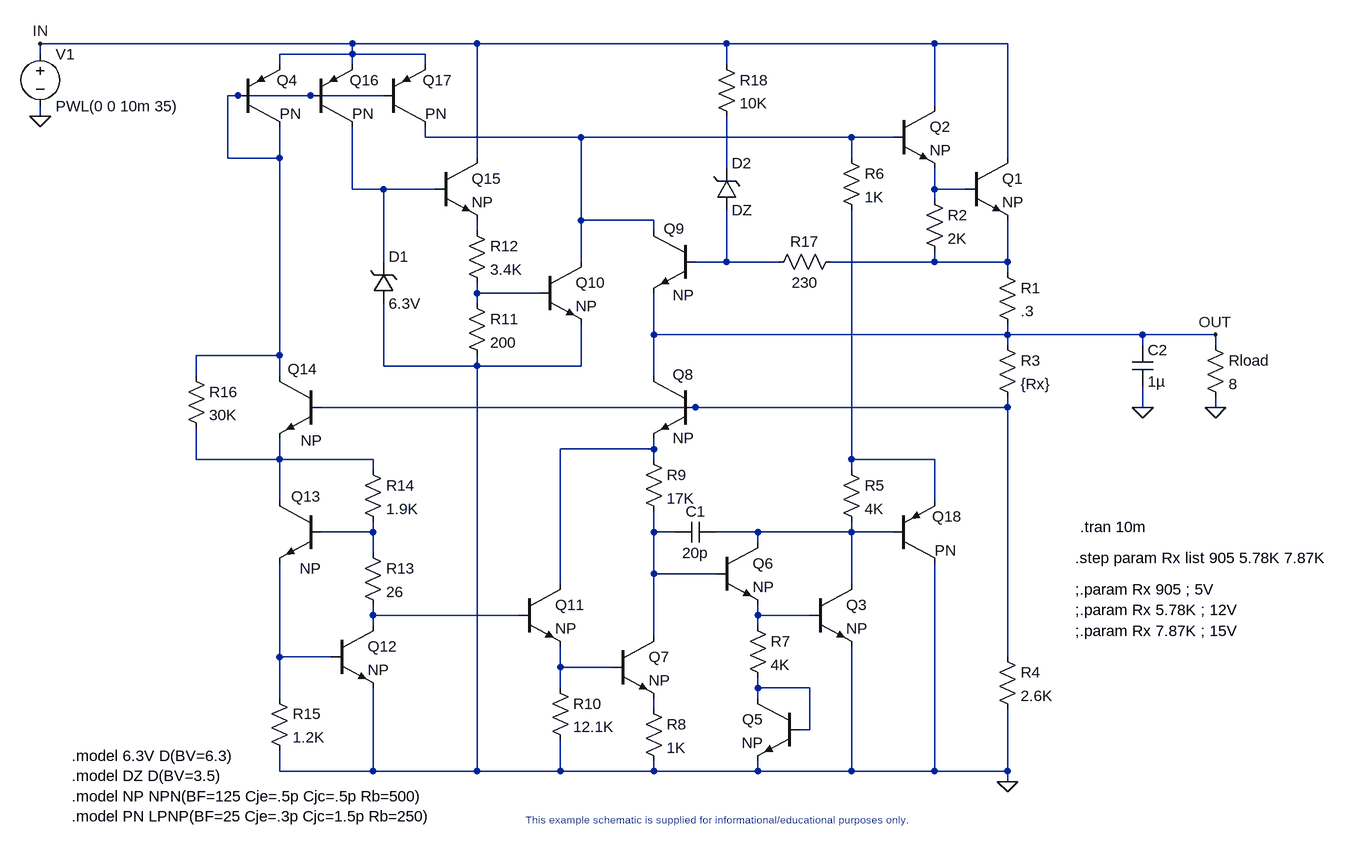
[diagram p0: schematic LM78XX.asc]
LM78XX.asc, the LTspice schematic file:
Version 4
SHEET 1 2980 1688
WIRE 928 320 448 320
WIRE 1120 320 928 320
WIRE 1504 320 1120 320
WIRE 1824 320 1504 320
WIRE 1936 320 1824 320
WIRE 448 336 448 320
WIRE 928 336 928 320
WIRE 928 336 816 336
WIRE 1040 336 928 336
WIRE 816 352 816 336
WIRE 928 352 928 336
WIRE 1040 352 1040 336
WIRE 1504 352 1504 320
WIRE 752 400 736 400
WIRE 864 400 752 400
WIRE 976 400 864 400
WIRE 1824 416 1824 320
WIRE 448 432 448 416
WIRE 1040 464 1040 448
WIRE 1280 464 1040 464
WIRE 1696 464 1280 464
WIRE 1760 464 1696 464
WIRE 736 496 736 400
WIRE 816 496 816 448
WIRE 816 496 736 496
WIRE 1120 496 1120 320
WIRE 1696 496 1696 464
WIRE 1936 496 1936 320
WIRE 1504 512 1504 432
WIRE 928 544 928 448
WIRE 976 544 928 544
WIRE 1056 544 976 544
WIRE 1824 544 1824 512
WIRE 1872 544 1824 544
WIRE 1824 560 1824 544
WIRE 1280 592 1280 464
WIRE 1392 592 1280 592
WIRE 1120 608 1120 592
WIRE 1392 608 1392 592
WIRE 976 656 976 544
WIRE 1280 656 1280 592
WIRE 1504 656 1504 576
WIRE 1504 656 1456 656
WIRE 1584 656 1504 656
WIRE 1824 656 1824 640
WIRE 1824 656 1664 656
WIRE 1936 656 1936 592
WIRE 1936 656 1824 656
WIRE 1936 672 1936 656
WIRE 1120 704 1120 688
WIRE 1216 704 1120 704
WIRE 1120 720 1120 704
WIRE 1392 768 1392 704
WIRE 1936 768 1936 752
WIRE 1936 768 1392 768
WIRE 2144 768 1936 768
WIRE 2256 768 2144 768
WIRE 1936 784 1936 768
WIRE 2144 784 2144 768
WIRE 2256 784 2256 768
WIRE 816 800 816 496
WIRE 816 800 688 800
WIRE 976 816 976 720
WIRE 1120 816 1120 800
WIRE 1120 816 976 816
WIRE 1280 816 1280 752
WIRE 1280 816 1120 816
WIRE 688 832 688 800
WIRE 816 832 816 800
WIRE 1392 832 1392 768
WIRE 1456 880 880 880
WIRE 1936 880 1936 864
WIRE 1936 880 1456 880
WIRE 2144 880 2144 848
WIRE 2256 880 2256 864
WIRE 1392 944 1392 928
WIRE 1392 944 1248 944
WIRE 688 960 688 912
WIRE 816 960 816 928
WIRE 816 960 688 960
WIRE 960 960 816 960
WIRE 1392 960 1392 944
WIRE 1696 960 1696 576
WIRE 1824 960 1696 960
WIRE 960 976 960 960
WIRE 1696 976 1696 960
WIRE 816 1024 816 960
WIRE 1824 1024 1824 960
WIRE 960 1072 960 1056
WIRE 960 1072 880 1072
WIRE 1392 1072 1392 1040
WIRE 1424 1072 1392 1072
WIRE 1552 1072 1488 1072
WIRE 1696 1072 1696 1056
WIRE 1696 1072 1552 1072
WIRE 1760 1072 1696 1072
WIRE 1552 1088 1552 1072
WIRE 960 1104 960 1072
WIRE 1392 1136 1392 1072
WIRE 1488 1136 1392 1136
WIRE 1248 1152 1248 944
WIRE 1696 1152 1696 1072
WIRE 960 1200 960 1184
WIRE 1184 1200 960 1200
WIRE 1552 1200 1552 1184
WIRE 1632 1200 1552 1200
WIRE 960 1216 960 1200
WIRE 1552 1216 1552 1200
WIRE 1392 1232 1392 1136
WIRE 816 1264 816 1120
WIRE 896 1264 816 1264
WIRE 1936 1264 1936 880
WIRE 1248 1280 1248 1248
WIRE 1328 1280 1248 1280
WIRE 1248 1312 1248 1280
WIRE 1552 1312 1552 1296
WIRE 1632 1312 1552 1312
WIRE 816 1328 816 1264
WIRE 1552 1328 1552 1312
WIRE 1392 1344 1392 1328
WIRE 1632 1376 1632 1312
WIRE 1632 1376 1616 1376
WIRE 816 1440 816 1408
WIRE 960 1440 960 1312
WIRE 960 1440 816 1440
WIRE 1120 1440 1120 816
WIRE 1120 1440 960 1440
WIRE 1248 1440 1248 1392
WIRE 1248 1440 1120 1440
WIRE 1392 1440 1392 1424
WIRE 1392 1440 1248 1440
WIRE 1552 1440 1552 1424
WIRE 1552 1440 1392 1440
WIRE 1696 1440 1696 1248
WIRE 1696 1440 1552 1440
WIRE 1824 1440 1824 1120
WIRE 1824 1440 1696 1440
WIRE 1936 1440 1936 1344
WIRE 1936 1440 1824 1440
WIRE 1936 1456 1936 1440
FLAG 1936 1456 0
FLAG 2256 768 OUT
FLAG 448 320 IN
FLAG 448 432 0
FLAG 2256 880 0
FLAG 2144 880 0
SYMBOL NPN 1872 496 R0
SYMATTR InstName Q1
SYMATTR Value NP
SYMBOL npn 1760 416 R0
SYMATTR InstName Q2
SYMATTR Value NP
SYMBOL RES 1920 656 R0
SYMATTR InstName R1
SYMATTR Value .3
SYMBOL res 1808 544 R0
SYMATTR InstName R2
SYMATTR Value 2K
SYMBOL res 1920 768 R0
SYMATTR InstName R3
SYMATTR Value {Rx}
SYMBOL res 1920 1248 R0
SYMATTR InstName R4
SYMATTR Value 2.6K
SYMBOL npn 1632 1152 R0
SYMATTR InstName Q3
SYMATTR Value NP
SYMBOL PNP 752 448 M180
WINDOW 0 60 72 Left 2
WINDOW 3 64 20 Left 2
SYMATTR InstName Q4
SYMATTR Value PN
SYMBOL res 1680 960 R0
SYMATTR InstName R5
SYMATTR Value 4K
SYMBOL res 1680 480 R0
SYMATTR InstName R6
SYMATTR Value 1K
SYMBOL npn 1616 1328 M0
SYMATTR InstName Q5
SYMATTR Value NP
SYMBOL res 1536 1200 R0
SYMATTR InstName R7
SYMATTR Value 4K
SYMBOL npn 1488 1088 R0
SYMATTR InstName Q6
SYMATTR Value NP
SYMBOL cap 1488 1056 R90
WINDOW 0 0 32 VBottom 2
WINDOW 3 32 32 VTop 2
SYMATTR InstName C1
SYMATTR Value 20p
SYMBOL npn 1328 1232 R0
SYMATTR InstName Q7
SYMATTR Value NP
SYMBOL res 1376 1328 R0
SYMATTR InstName R8
SYMATTR Value 1K
SYMBOL res 1376 944 R0
SYMATTR InstName R9
SYMATTR Value 17K
SYMBOL npn 1456 832 M0
WINDOW 0 35 -3 Right 2
WINDOW 3 35 95 Right 2
SYMATTR InstName Q8
SYMATTR Value NP
SYMBOL npn 1456 608 M0
WINDOW 0 49 -3 Right 2
WINDOW 3 35 99 Right 2
SYMATTR InstName Q9
SYMATTR Value NP
SYMBOL npn 1216 656 R0
SYMATTR InstName Q10
SYMATTR Value NP
SYMBOL npn 1184 1152 R0
SYMATTR InstName Q11
SYMATTR Value NP
SYMBOL res 1232 1296 R0
SYMATTR InstName R10
SYMATTR Value 12.1K
SYMBOL res 1104 704 R0
SYMATTR InstName R11
SYMATTR Value 200
SYMBOL res 1104 592 R0
SYMATTR InstName R12
SYMATTR Value 3.4K
SYMBOL npn 896 1216 R0
SYMATTR InstName Q12
SYMATTR Value NP
SYMBOL res 944 1088 R0
SYMATTR InstName R13
SYMATTR Value 26
SYMBOL res 944 960 R0
SYMATTR InstName R14
SYMATTR Value 1.9K
SYMBOL npn 880 1024 M0
WINDOW 0 46 -7 Right 2
WINDOW 3 33 104 Right 2
SYMATTR InstName Q13
SYMATTR Value NP
SYMBOL res 800 1312 R0
SYMATTR InstName R15
SYMATTR Value 1.2K
SYMBOL npn 880 832 M0
WINDOW 0 51 -11 Right 2
WINDOW 3 31 99 Right 2
SYMATTR InstName Q14
SYMATTR Value NP
SYMBOL res 672 816 R0
SYMATTR InstName R16
SYMATTR Value 30K
SYMBOL npn 1056 496 R0
SYMATTR InstName Q15
SYMATTR Value NP
SYMBOL zener 960 720 M180
WINDOW 0 24 72 Left 2
WINDOW 3 24 0 Left 2
SYMATTR InstName D1
SYMATTR Value 6.3V
SYMBOL res 1680 640 R90
WINDOW 0 0 56 VBottom 2
WINDOW 3 32 56 VTop 2
SYMATTR InstName R17
SYMATTR Value 230
SYMBOL zener 1488 576 M180
WINDOW 0 24 72 Left 2
WINDOW 3 24 0 Left 2
SYMATTR InstName D2
SYMATTR Value DZ
SYMBOL res 1488 336 R0
SYMATTR InstName R18
SYMATTR Value 10K
SYMBOL pnp 864 448 M180
WINDOW 0 60 72 Left 2
WINDOW 3 64 20 Left 2
SYMATTR InstName Q16
SYMATTR Value PN
SYMBOL pnp 976 448 M180
WINDOW 0 60 72 Left 2
WINDOW 3 64 20 Left 2
SYMATTR InstName Q17
SYMATTR Value PN
SYMBOL cap 2128 784 R0
SYMATTR InstName C2
SYMATTR Value 1µ
SYMBOL res 2240 768 R0
SYMATTR InstName Rload
SYMATTR Value 8
SYMBOL VOLTAGE 448 320 R0
SYMATTR InstName V1
SYMATTR Value PWL(0 0 10m 35)
SYMBOL pnp 1760 1120 M180
WINDOW 0 60 72 Left 2
WINDOW 3 64 20 Left 2
SYMATTR InstName Q18
SYMATTR Value PN
TEXT 496 1416 Left 2 !.model 6.3V D(BV=6.3)\n.model DZ D(BV=3.5)\n.model NP NPN(BF=125 Cje=.5p Cjc=.5p Rb=500)\n.model PN LPNP(BF=25 Cje=.3p Cjc=1.5p Rb=250)
TEXT 2048 1064 Left 2 !.tran 10m
TEXT 2040 1160 Left 2 !;.param Rx 905 ; 5V
TEXT 2040 1192 Left 2 !;.param Rx 5.78K ; 12V
TEXT 2040 1224 Left 2 !;.param Rx 7.87K ; 15V
TEXT 1480 1504 Top 1 ;This example schematic is supplied for informational/educational purposes only.
TEXT 2040 1112 Left 2 !.step param Rx list 905 5.78K 7.87K

The netlist it stands for:
* LM78XX.asc
Q1 IN N005 N008 0 NP
Q2 IN N002 N005 0 NP
R1 N008 OUT .3
R2 N005 N008 2K
R3 OUT N010 {Rx}
R4 N010 0 2.6K
Q3 N016 N018 0 0 NP
Q4 N001 N001 IN 0 PN
R5 N013 N016 4K
R6 N002 N013 1K
Q5 N021 N021 0 0 NP
R7 N018 N021 4K
Q6 N016 N015 N018 0 NP
C1 N016 N015 20p
Q7 N015 N020 N022 0 NP
R8 N022 0 1K
R9 N011 N015 17K
Q8 OUT N010 N011 0 NP
Q9 N002 N007 OUT 0 NP
Q10 N002 N009 0 0 NP
Q11 N011 N017 N020 0 NP
R10 N020 0 12.1K
R11 N009 0 200
R12 N006 N009 3.4K
Q12 N017 N019 0 0 NP
R13 N014 N017 26
R14 N012 N014 1.9K
Q13 N012 N014 N019 0 NP
R15 N019 0 1.2K
Q14 N001 N010 N012 0 NP
R16 N001 N012 30K
Q15 IN N004 N006 0 NP
D1 0 N004 6.3V
R17 N008 N007 230
D2 N007 N003 DZ
R18 IN N003 10K
Q16 N004 N001 IN 0 PN
Q17 N002 N001 IN 0 PN
C2 OUT 0 1µ
Rload OUT 0 8
V1 IN 0 PWL(0 0 10m 35)
Q18 0 N016 N013 0 PN
.model D D
.lib standard.dio
.model NPN NPN
.model PNP PNP
.lib standard.bjt
.model 6.3V D(BV=6.3)
.model DZ D(BV=3.5)
.model NP NPN(BF=125 Cje=.5p Cjc=.5p Rb=500)
.model PN LPNP(BF=25 Cje=.3p Cjc=1.5p Rb=250)
.tran 10m
;.param Rx 905 ; 5V
;.param Rx 5.78K ; 12V
;.param Rx 7.87K ; 15V
* This example schematic is supplied for informational/educational purposes only.
.step param Rx list 905 5.78K 7.87K
.backanno
.end